# Altium schematic sheet Debug.SchDoc
size A4; SheetNumber: 3; SheetTotal: 6
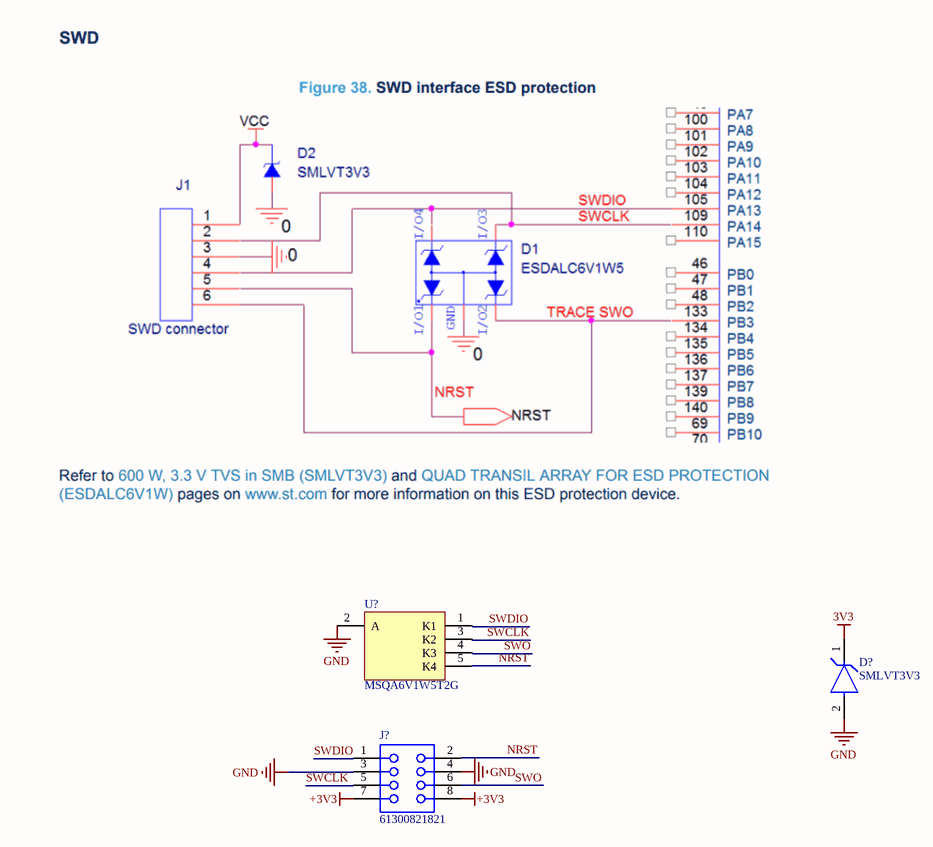
[diagram p0: Debug.SchDoc]

## Parts
D?  SMLVT3V3  [FP-SMB-MFG]
J?  61300821821  [61300821821]
U?  MSQA6V1W5T2G  [ONSC-SC70-5-419A-02_V]

## Nets
3V3: D?.1(K)
+3V3: J?.7 J?.8
GND: D?.2(A) J?.3 J?.4 U?.2(A)
NRST: J?.2 U?.5(K4)
SWCLK: J?.5 U?.3(K2)
SWDIO: J?.1 U?.1(K1)
SWO: J?.6 U?.4(K3)

## Library data of the parts
D? = SMLVT3V3: TVS DIODE 3.3V 10.3V SMB; Manufacturer: STMicroelectronics; Standoff Height: 0.05mm; Max Junction Temp: +175°C; Capacitance: 5200pF; Breakdown Voltage: 4.1V; Peak Pulse Power: 600W; Clamping Voltage: 7.3V; Direction: Unidirectional; Number Of Channels: 1; Peak Pulse Current: 50A; Value: 5200pF; ComponentLink2Description: Datasheet; Digikey Description: TVS DIODE 3.3V 10.3V SMB; Automotive: No; Temperature Range Low: -55°C; Device Class L2: TVS Diodes; RoHS: TRUE; ComponentLink2URL: https://www.st.com/resource/en/datasheet/smlvt3v3.pdf; Temperature: -55°C to +175°C; Device Class L3: unset; Package: SMB; Lead Free: Yes; Mouser Description: TVS Diodes - Transient Voltage Suppressors 600W 3.3V Unidirect; Height: 2.65mm; Octopart: https://octopart.com/smlvt3v3-stmicroelectronics-347049; Temperature Range High: +175°C; Category: Diode; Manufacturer Part Number: SMLVT3V3; Device Class L1: Circuit Protection
J? = CMP-1502-01329-2: NexarPartId: 61924725; Current Rating: 3A; Gender: Female; Operating Supply Voltage: 250V; Contact Resistance: 20mΩ; Orientation: Vertical; Lead Pitch: 2.54mm; RoHS: Non-Compliant; Number of Pins: 8
U? = CMP-1063-00034-1: Quad Array ESD Protection Diodes with Low Clamping Voltage, 5-Pin SC70, Pb-Free, Tape and Reel; Manufacturer: On Semiconductor; Number of Lines: 4; IR Max (uA): 1; V(BR) Min (V): 6.1; PPK Max (W): 150; C Max (pF): 90; Direction: Unidirectional; ComponentLink2URL: http://www.onsemi.cn/pub_link/Collateral/MSQA6V1W5T2-D.PDF; ComponentLink2Description: Datasheet; PackageDescription: 5-Pin Small Outline Transistor, Body 2 x 1.25 mm, Pitch 0.65 mm; PartNumber: MSQA6V1W5T2G; PackageReference: SC70-5-419A-02; Packing: Tape and Reel; Mounting Technology: Surface Mount; ComponentLink3Description: Package Specification; RoHS: Pb-Free; PackageVersion: Rev. L, 01/2013; ComponentLink3URL: http://www.onsemi.cn/pub_link/Collateral/419A-02.PDF; DatasheetVersion: Rev. 7; ComponentLink1Description: Manufacturer URL; ComponentLink1URL: http://www.onsemi.com/